# EAGLE design edubrm-shield-1 (EAGLE 5.11)
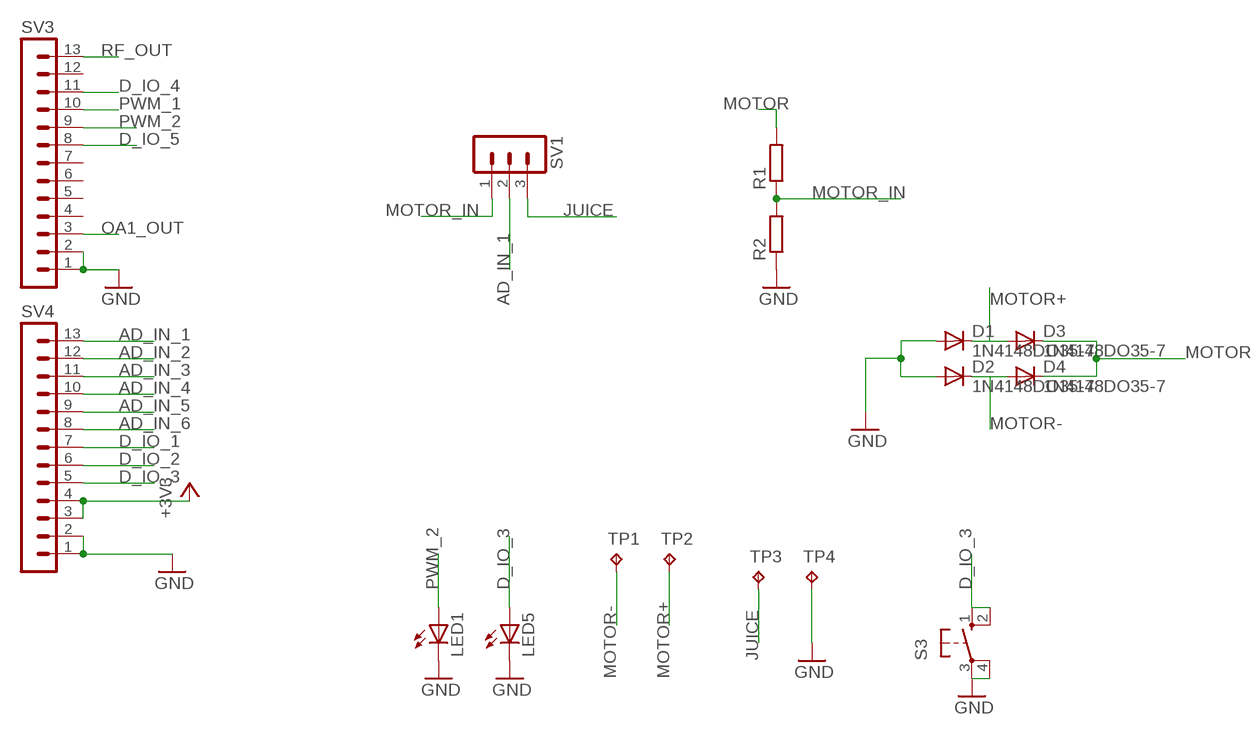
[diagram p0: schematic, sheet 1]

## Parts
D1  1N4148DO35-7  [DO35-7]
D2  1N4148DO35-7  [DO35-7]
D3  1N4148DO35-7  [DO35-7]
D4  1N4148DO35-7  [DO35-7]
LED1  LED3MM  [LED3MM]
LED5  LED3MM  [LED3MM]
R1  R-EU_M1206  [M1206]
R2  R-EU_M1206  [M1206]
S3  10-XX  [B3F-10XX]
SV1  MA03-1  [MA03-1]
SV3  MA13-1  [MA13-1]
SV4  MA13-1  [MA13-1]
TP1  TPPAD1-20Y  [P1-20Y]
TP2  TPPAD1-20Y  [P1-20Y]
TP3  TPPAD1-20Y  [P1-20Y]
TP4  TPPAD1-20Y  [P1-20Y]

## Nets
AD_IN_1: SV1.2 SV4.13
AD_IN_2: SV4.12
AD_IN_3: SV4.11
AD_IN_4: SV4.10
AD_IN_5: SV4.9
AD_IN_6: SV4.8
D_IO_1: SV4.7
D_IO_2: SV4.6
D_IO_3: LED5.A S3.1(S) S3.2(S1) SV4.5
D_IO_4: SV3.11
D_IO_5: SV3.8
GND: D1.A D2.A LED1.K(C) LED5.K(C) R2.1 S3.3(P) S3.4(P1) SV3.1 SV3.2 SV4.1 SV4.2 TP4.TP
JUICE: SV1.3 TP3.TP
MOTOR: D3.C D4.C R1.2
MOTOR+: D1.C D3.A TP2.TP
MOTOR-: D2.C D4.A TP1.TP
MOTOR_IN: R1.1 R2.2 SV1.1
OA1_OUT: SV3.3
PWM_1: SV3.10
PWM_2: LED1.A SV3.9
RF_OUT: SV3.13
VCC: SV4.3 SV4.4 ; supply symbol labelled +3V3
Unconnected: SV3.4 SV3.5 SV3.6 SV3.7 SV3.12

## Library data of the parts
D1-D4 = diode:1N4148: DIODE high speed (Philips)
LED1 LED5 = led:LED: LED OSRAM: - CHIPLED LG R971, LG N971, LY N971, LG Q971, LY Q971, LO R971, LY R971 LH N974, LH R974 LS Q976, LO Q976, LY Q976 LO Q996 - Hyper CHIPLED LW Q18S LB Q993, LB Q99A, LB R99A - SideLED LS A670, LO A670, LY A670, LG A670, LP A670 LB A673, LV A673, LT A673, LW A673 LH A674 LY A675 LS A676, LA A676, LO A676, LY A676, LW A676 LS A679, LY A679, LG A679 - Hyper Micro SIDELED® LS Y876, LA Y876, LO Y876, LY Y876 LT Y87S - SmartLED LW L88C, LW L88S LB L89C, LB L89S, LG L890 LS L89K, LO L89K, LY L89K LS L896, LA L896, LO L896, LY L896 - TOPLED LS T670, LO T670, LY T670, LG T670, LP T670 LSG T670, LSP T670, LSY T670, LOP T670, LYG T670 LG T671, LOG T671, LSG T671 LB T673, LV T673, LT T673, LW T673 LH T674 LS T676, LA T676, LO T676, LY T676, LB T676, LH T676, LSB T676, LW T676 LB T67C, LV T67C, LT T67C, LS T67K, LO T67K, LY T67K, LW E67C LS E67B, LA E67B, LO E67B, LY E67B, LB E67C, LV E67C, LT E67C LW T67C LS T679, LY T679, LG T679 LS T770, LO T770, LY T770, LG T770, LP T770 LB T773, LV T773, LT T773, LW T773 LH T774 LS E675, LA E675, LY E675, LS T675 LS T776, LA T776, LO T776, LY T776, LB T776 LHGB T686 LT T68C, LB T68C - Hyper Mini TOPLED® LB M676 - Mini TOPLED Santana® LG M470 LS M47K, LO M47K, LY M47K Source: http://www.osram.convergy.de LUXEON: - LUMILED® LXK2-PW12-R00, LXK2-PW12-S00, LXK2-PW14-U00, LXK2-PW14-V00 LXK2-PM12-R00, LXK2-PM12-S00, LXK2-PM14-U00 LXK2-PE12-Q00, LXK2-PE12-R00, LXK2-PE12-S00, LXK2-PE14-T00, LXK2-PE14-U00 LXK2-PB12-K00, LXK2-PB12-L00, LXK2-PB12-M00, LXK2-PB14-N00, LXK2-PB14-P00, LXK2-PB14-Q00 LXK2-PR12-L00, LXK2-PR12-M00, LXK2-PR14-Q00, LXK2-PR14-R00 LXK2-PD12-Q00, LXK2-PD12-R00, LXK2-PD12-S00 LXK2-PH12-R00, LXK2-PH12-S00 LXK2-PL12-P00, LXK2-PL12-Q00, LXK2-PL12-R00 Source: www.luxeon.com KINGBRIGHT: KA-3528ASYC Source: www.kingbright.com
R1 R2 = rcl:R-EU_: RESISTOR, European symbol
S3 = switch-omron:10-XX: OMRON SWITCH; MPN: B3F-1000; OC_FARNELL: 176432; OC_NEWARK: 36M3542
SV1 = con-lstb:MA03-1: PIN HEADER; OC_FARNELL: unknown; OC_NEWARK: unknown
SV3 SV4 = con-lstb:MA13-1: PIN HEADER; OC_FARNELL: unknown; OC_NEWARK: unknown
TP1-TP4 = testpad:TP: Test pad

## Board
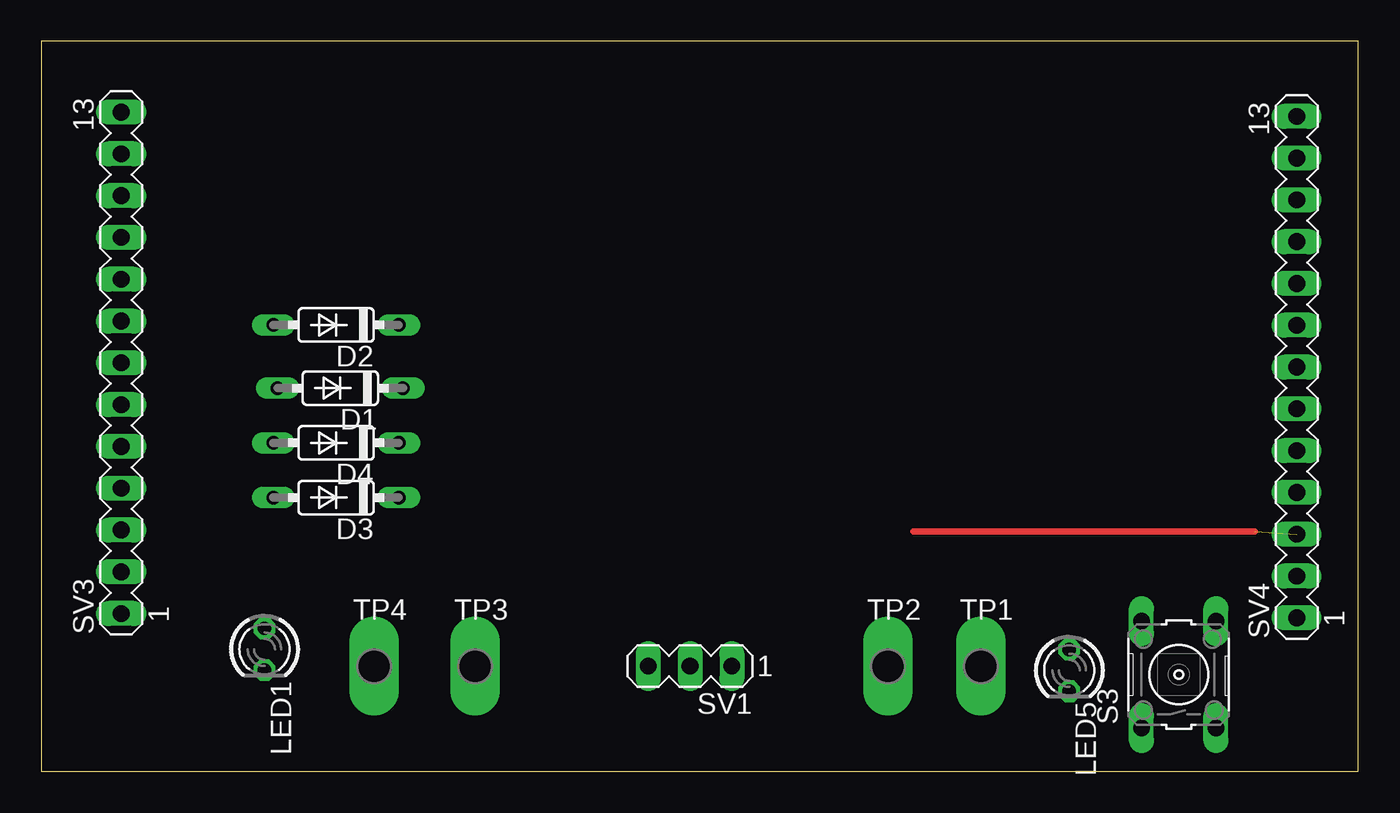
[diagram p1: board, top side]
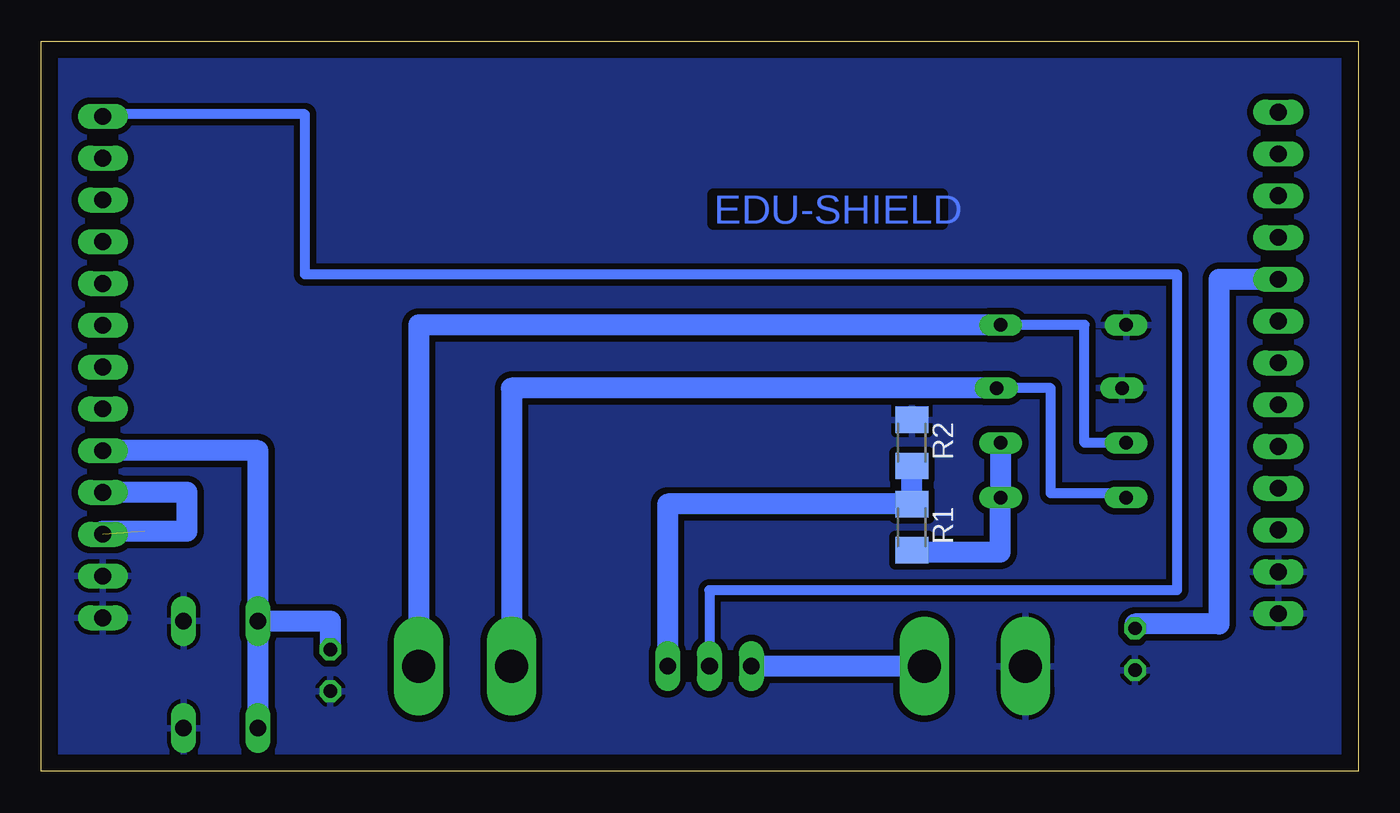
[diagram p2: board, bottom side, seen from below]

Size 80.03 x 44.38 mm. Coordinates in mm from the lower left corner, seen from the top.
Outline: 0,0 80.03,0 80.03,44.38 0,44.38 0,0
Copper layers (1*16): Top 0.035mm / dielectric 1.5mm / Bottom 0.035mm
Design rules "default *": minimum track width 10mil, minimum drill 24mil, track to track 15mil, track to pad 12mil, pad to pad 8mil, via to via 8mil, smd to smd 8mil, copper to edge 40mil, drill to drill 8mil, minimum pad ring 10mil, minimum via ring 8mil, stop-mask expansion 4mil, vias tented up to drill 0mil, thermal gap 10mil

### Footprints (pad centres in the part's own frame; a part is rotated, then mirrored left to right if it is on the bottom)
DO35-7 = drill 0.813 long: A 3.81,0; C -3.81,0
LED3MM = drill 0.813 octagon: A -1.27,0; K 1.27,0
M1206 = smd 1.6 x 2: 1 -1.4,0; 2 1.4,0
B3F-10XX = drill 1.016 long: 1 -3.251,2.261; 2 3.251,2.261; 3 -3.251,-2.261; 4 3.251,-2.261
MA03-1 = drill 1.016 long: 1 -2.54,0; 2 0,0; 3 2.54,0
MA13-1 = drill 1.016 long: 1 -15.24,0; 2 -12.7,0; 3 -10.16,0; 4 -7.62,0; 5 -5.08,0; 6 -2.54,0; 7 0,0; 8 2.54,0; 9 5.08,0; 10 7.62,0; 11 10.16,0; 12 12.7,0; 13 15.24,0
P1-20Y = drill 2.007 pad 2.54 long: TP 0,0

### Placement (x,y rotation side)
D1  18.18,23.3 180 top
D2  17.92,27.14 180 top
D3  17.92,16.64 180 top
D4  17.92,19.97 180 top
LED1  13.57,7.42 270 top
LED5  62.46,6.14 270 top
R1  27.14,14.85 270 bottom
R2  27.14,19.97 270 bottom
S3  69.12,5.89 90 top
SV1  39.42,6.4 180 top
SV3  4.86,24.83 90 top
SV4  76.29,24.58 90 top
TP1  57.09,6.4 0 top
TP2  51.46,6.4 0 top
TP3  26.37,6.4 0 top
TP4  20.22,6.4 0 top

### Tracks (layer width: path | path; a pad name or v marks a point on that pad's centre or on a via)
AD_IN_1
  Bottom 0.61: SV1.2 39.42,11.01 11.01,11.01 11.01,30.21 64,30.21 64,39.94 76.29,39.94 SV4.13
D_IO_3
  Bottom 1.27: SV4.5 66.86,19.5 S3.2 | S3.2 62.46,9.14 LED5.A | S3.1 S3.2
GND
  pour Bottom: -1.54,45.57 81.66,45.57 81.66,-1.79 -1.54,-1.79
JUICE
  Bottom 1.27: TP3.TP SV1.3
MOTOR
  Bottom 1.27: D4.C D3.C 21.76,16.64 21.76,13.31 27.14,13.31 R1.2
MOTOR+
  Bottom 0.61: D1.C 18.69,23.3 18.69,16.9 14.11,16.9 D3.A
  Bottom 1.27: D1.C 51.46,23.3 TP2.TP
MOTOR-
  Bottom 0.61: D2.C 16.64,27.14 16.64,19.97 D4.A
  Bottom 1.27: D2.C 57.09,27.14 TP1.TP
MOTOR_IN
  Bottom 1.27: R2.2 R1.1 41.96,16.25 SV1.1
PWM_2
  Bottom 1.27: SV3.9 8.45,29.91 8.45,8.96 13.57,8.96 LED1.A
VCC  (1 unrouted)
  Top 0.406: 52.99,14.59 73.73,14.59
  Bottom 1.27: SV4.4 71.17,16.96 71.17,14.59 76.29,14.59 SV4.3

### Text on the board
Bottom: EDU-SHIELD